# Altium project Avionics_Sensor_Module.PrjPcb
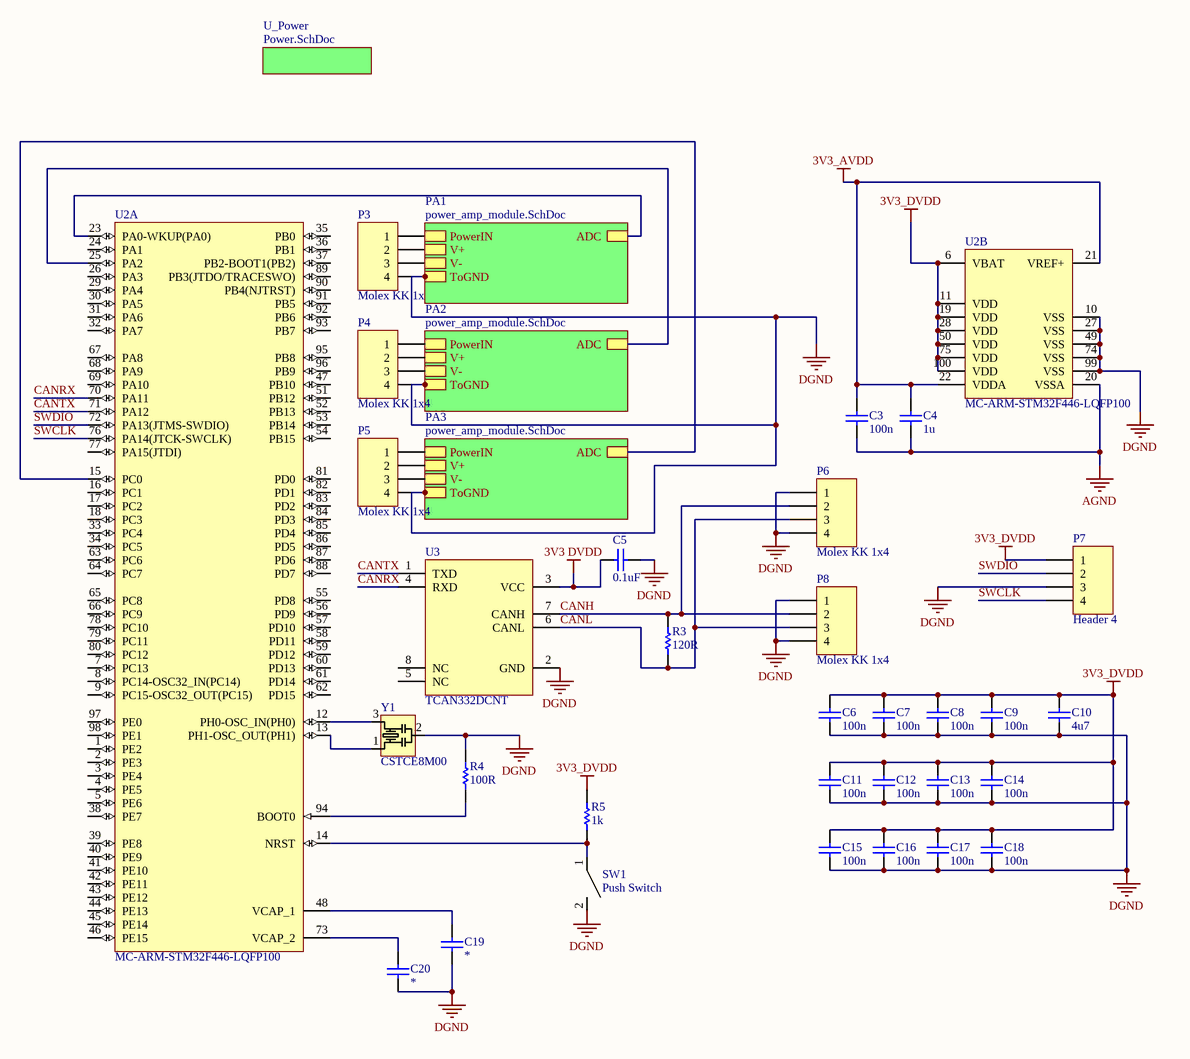
[diagram p0: micro_schematic.SchDoc]
2 sheets, 42 parts. Net scope: hierarchical (ports join the sheet entries above them; power ports are global).
Board file: Force_Sensor_Board.PcbDoc
Sheets:
  micro_schematic.SchDoc
    U_Power = Power.SchDoc

## Sheet micro_schematic.SchDoc
size B

### Parts
C3  100n  [C0805]
C4  1u  [C0805]
C5  0.1uF  [C0805]
C6  100n  [C0805]
C7  100n  [C0805]
C8  100n  [C0805]
C9  100n  [C0805]
C10  4u7  [C0805]
C11  100n  [C0805]
C12  100n  [C0805]
C13  100n  [C0805]
C14  100n  [C0805]
C15  100n  [C0805]
C16  100n  [C0805]
C17  100n  [C0805]
C18  100n  [C0805]
C19  *  [C0805]
C20  *  [C0805]
P3  Molex KK 1x4  [Molex KK 4x1]
P4  Molex KK 1x4  [Molex KK 4x1]
P5  Molex KK 1x4  [Molex KK 4x1]
P6  Molex KK 1x4  [Molex KK 4x1]
P7  Header 4  [HDR1X4]
P8  Molex KK 1x4  [Molex KK 4x1]
R3  120R  [R0805]
R4  100R  [R0805]
R5  1k  [R0805]
SW1  Push Switch  [PUSHBUTTON]
U2  MC-ARM-STM32F446-LQFP100  [STM-LQFP100_N]  (parts A,B of 2)
U3  TCAN332DCNT  [SOT-23-8]
Y1  CSTCE8M00  [8MHz Ceramic Resonator]

### Sub-sheets
PA1 = power_amp_module.SchDoc (file not in this document): ADC, PowerIN, V-, ToGND, V+
PA2 = power_amp_module.SchDoc (file not in this document): ADC, PowerIN, V-, ToGND, V+
PA3 = power_amp_module.SchDoc (file not in this document): ADC, PowerIN, V-, ToGND, V+
U_Power = Power.SchDoc: no entries

### Nets
3V3 DVDD: C5.1 U3.3(VCC)
3V3_AVDD: C3.1 C4.1 U2.21(VREF+) U2.22(VDDA)
3V3_DVDD: C6.1 C7.1 C8.1 C9.1 C10.1 C11.1 C12.1 C13.1 C14.1 C15.1 C16.1 C17.1 C18.1 P7.1 R5.2 U2.6(VBAT) U2.11(VDD) U2.19(VDD) U2.28(VDD) U2.50(VDD) U2.75(VDD) U2.100(VDD)  [project net VOUT_3.3V]
AGND: C3.2 C4.2 U2.20(VSSA)
DGND: C5.2 C6.2 C7.2 C8.2 C9.2 C10.2 C11.2 C12.2 C13.2 C14.2 C15.2 C16.2 C17.2 C18.2 C19.2 C20.2 P3.4 P4.4 P5.4 P6.1 P6.4 P7.3 P8.1 P8.4 R4.2 SW1.2 U2.10(VSS) U2.27(VSS) U2.49(VSS) U2.74(VSS) U2.99(VSS) U3.2(GND) Y1.2(GND) ; sheet PA2/ToGND, sheet PA3/ToGND, sheet PA1/ToGND
CANH: P6.2 P8.2 R3.2 U3.7(CANH)
CANL: P6.3 P8.3 R3.1 U3.6(CANL)
CANRX: U2.70(PA11) U3.4(RXD)
CANTX: U2.71(PA12) U3.1(TXD)
SWCLK: P7.4 U2.76(PA14(JTCK-SWCLK))
SWDIO: P7.2 U2.72(PA13(JTMS-SWDIO))
NetC19_1: C19.1 U2.48(VCAP_1)
NetC20_1: C20.1 U2.73(VCAP_2)
NetP3_1: P3.1 ; sheet PA1/PowerIN
NetP3_2: P3.2 ; sheet PA1/V+
NetP3_3: P3.3 ; sheet PA1/V-
NetP4_1: P4.1 ; sheet PA2/PowerIN
NetP4_2: P4.2 ; sheet PA2/V+
NetP4_3: P4.3 ; sheet PA2/V-
NetP5_1: P5.1 ; sheet PA3/PowerIN
NetP5_2: P5.2 ; sheet PA3/V+
NetP5_3: P5.3 ; sheet PA3/V-
NetR4_1: R4.1 U2.94(BOOT0)
NetR5_1: R5.1 SW1.1 U2.14(NRST)
NetU2_12: U2.12(PH0-OSC_IN(PH0)) Y1.3(OSC2)
NetU2_13: U2.13(PH1-OSC_OUT(PH1)) Y1.1(OSC1)
NetU2_15: U2.15(PC0) ; sheet PA3/ADC
NetU2_23: U2.23(PA0-WKUP(PA0)) ; sheet PA1/ADC
NetU2_25: U2.25(PA2) ; sheet PA2/ADC

Not connected (* = marked no-connect by the designer): U2 1(PE2) 2(PE3) 3(PE4) 4(PE5) 5(PE6) 7(PC13) 8(PC14-OSC32_IN(PC14)) 9(PC15-OSC32_OUT(PC15)) 16(PC1) 17(PC2) 18(PC3) 24(PA1) 26(PA3) 29(PA4) 30(PA5) 31(PA6) 32(PA7) 33(PC4) 34(PC5) 35(PB0) 36(PB1) 37(PB2-BOOT1(PB2)) 38(PE7) 39(PE8) 40(PE9) 41(PE10) 42(PE11) 43(PE12) 44(PE13) 45(PE14) 46(PE15) 47(PB10) 51(PB12) 52(PB13) 53(PB14) 54(PB15) 55(PD8) 56(PD9) 57(PD10) 58(PD11) 59(PD12) 60(PD13) 61(PD14) 62(PD15) 63(PC6) 64(PC7) 65(PC8) 66(PC9) 67(PA8) 68(PA9) 69(PA10) 77(PA15(JTDI)) 78(PC10) 79(PC11) 80(PC12) 81(PD0) 82(PD1) 83(PD2) 84(PD3) 85(PD4) 86(PD5) 87(PD6) 88(PD7) 89(PB3(JTDO/TRACESWO)) 90(PB4(NJTRST)) 91(PB5) 92(PB6) 93(PB7) 95(PB8) 96(PB9) 97(PE0) 98(PE1); U3 5(NC) 8(NC)

### Library data of the parts
C3-C20 = C0805: 0805 Capacitor
  C3 C6-C9 C11-C18: Value: 100n
  C4: Value: 1u
  C5: Value: 0.1uF
  C10: Value: 4u7
  C19 C20: Value: *
P3-P6 P8 = Molex KK 1x4: 1x4 Molex KK Connector
P7 = Header 4: Header, 4-Pin; LatestRevisionDate: 17-Jul-2002; LatestRevisionNote: Re-released for DXP Platform.; Publisher: Altium Limited
R3-R5 = R0805: RESISTOR 0805
  R3: Value: 120R
  R4: Value: 100R
  R5: Value: 1k
SW1 = PUSHBUTTON
U3 = TCAN332DCNT: IC TXRX CAN 3.3V SOT23-8
Y1 = CSTCE8M00: 8MHz Ceramic Resonator

## Sheet Power.SchDoc
size A
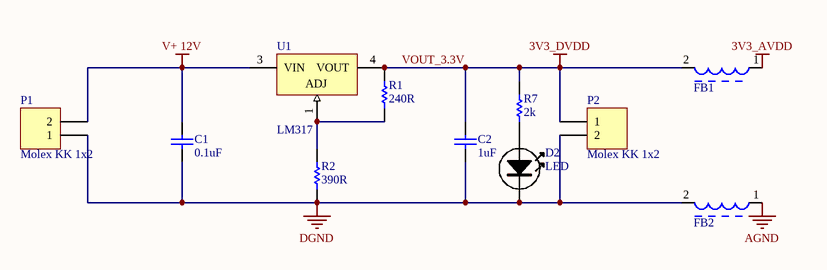
[diagram p1: Power.SchDoc]

### Parts
C1  0.1uF  [C0805]
C2  1uF  [C0805]
D2  LED  [0805LED]
FB1  FERRITE  [R0805]  (value not drawn)
FB2  FERRITE  [R0805]  (value not drawn)
P1  Molex KK 1x2  [Molex KK 2x1]
P2  Molex KK 1x2  [Molex KK 2x1]
R1  240R  [R0805]
R2  390R  [R0805]
R7  2k  [R0805]
U1  LM317  [D-PAK]

### Nets
3V3_AVDD: FB1.1
AGND: FB2.1
DGND: C1.2 C2.2 D2.K FB2.2 P1.1 P2.2 R2.1
V+ 12V: C1.1 P1.2 U1.3(VIN)
VOUT_3.3V: C2.1 FB1.2 P2.1 R1.2 R7.2 U1.4(VOUT)  [also labelled 3V3_DVDD]
NetD2_A: D2.A R7.1
NetR1_1: R1.1 R2.2 U1.1(ADJ)

### Library data of the parts
C1 C2 = C0805: 0805 Capacitor
  C1: Value: 0.1uF
  C2: Value: 1uF
D2 = LED: Manufacturer: OSRAM Opto Semiconductors Inc; Manufacturer Part Number: LS T676-Q1R2-1-Z; Reel: D13
FB1 FB2 = FERRITE: FERRITE BEAD 0805
P1 P2 = Molex KK 1x2: 1x2 Molex KK Connector
R1 R2 R7 = R0805: RESISTOR 0805
  R1: Value: 240R
  R2: Value: 390R
  R7: Value: 2k
U1 = LM317: Linear Voltage Regulator

## Nets that join several sheets
3V3_AVDD: micro_schematic (C3.1 C4.1 U2.21 U2.22), Power (FB1.1)
AGND: micro_schematic (C3.2 C4.2 U2.20), Power (FB2.1)
DGND: micro_schematic (33 pins), Power (7 pins)
VOUT_3.3V: micro_schematic (22 pins), Power (6 pins)